# EAGLE schematic receiver_pcb (EAGLE 6.1)
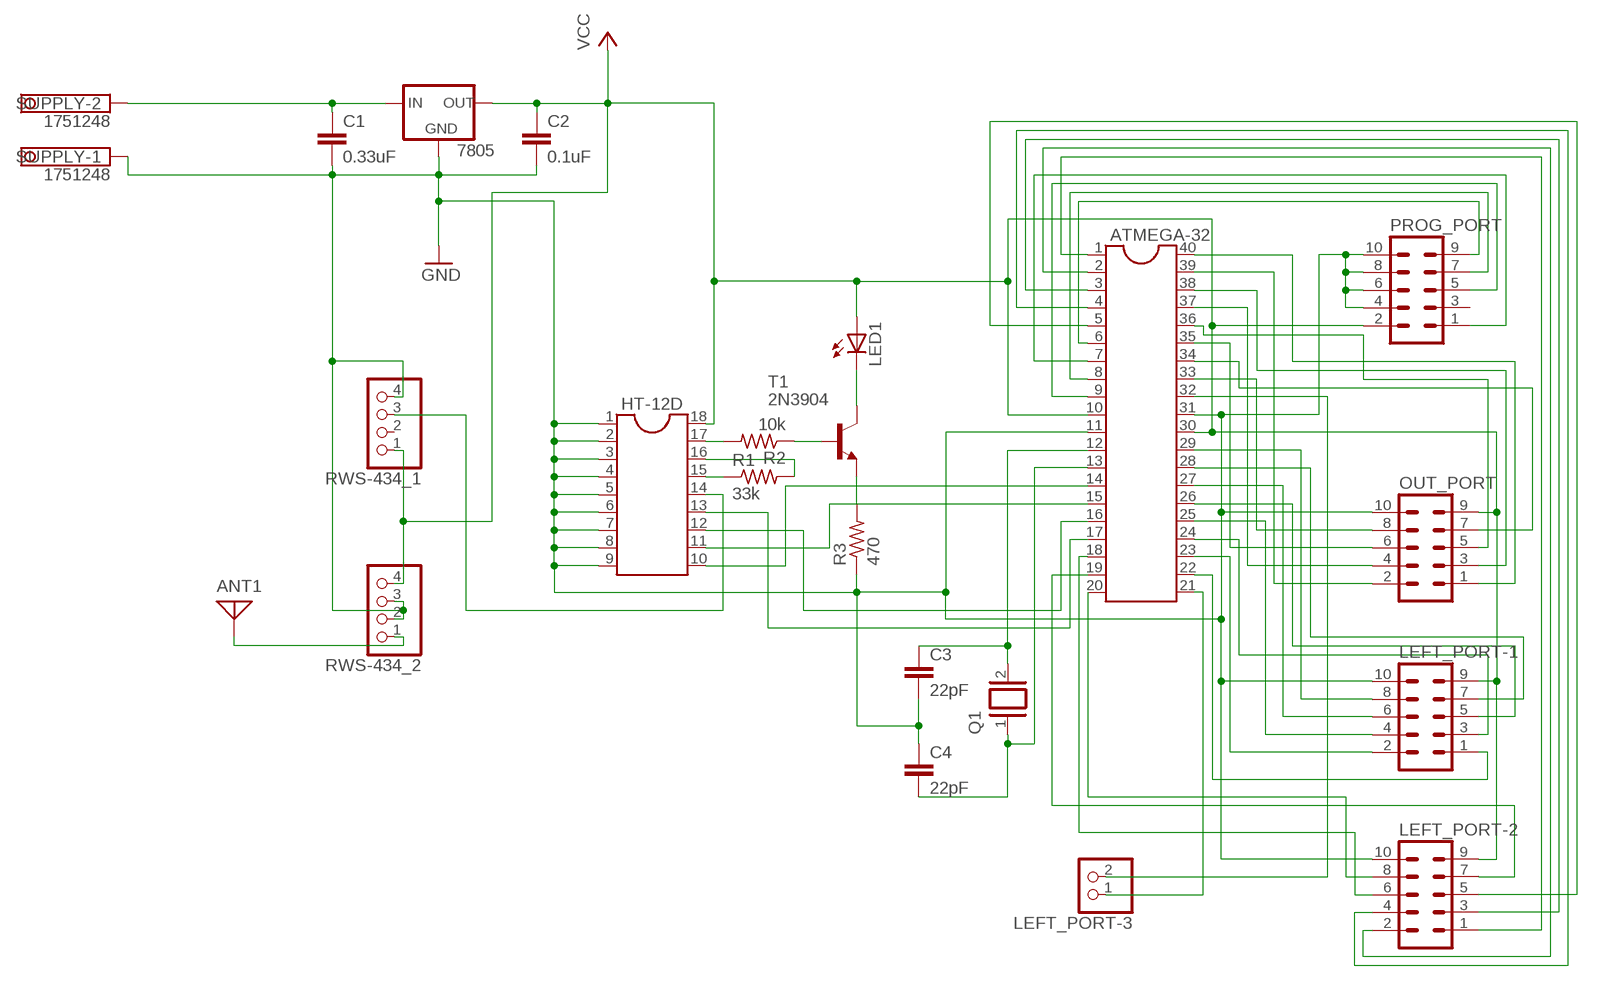
[diagram p0: schematic, sheet 1]

## Parts
7805  78XXS  [78XXS]
ANT1  ANTENNA  [PAD-01]
ATMEGA-32  DIL40  [DIL40]
C1  0.33uF  C2.5/2  [C2.5-2]
C2  0.1uF  C2.5/2  [C2.5-2]
C3  22pF  C2.5/2  [C2.5-2]
C4  22pF  C2.5/2  [C2.5-2]
HT-12D  DIL18  [DIL18]
LED1  LED5MM  [LED5MM]
LEFT_PORT-1  ML10  [ML10]
LEFT_PORT-2  ML10  [ML10]
LEFT_PORT-3  PINHD-1X2  [1X02]
OUT_PORT  ML10  [ML10]
PROG_PORT  ML10  [ML10]
Q1  XTAL/S  [QS]
R1  33k  R-US_0204/5  [0204/5]
R2  10k  R-US_0204/5  [0204/5]
R3  470  R-US_0204/5  [0204/5]
RWS-434_1  PINHD-1X4  [1X04]
RWS-434_2  PINHD-1X4  [1X04]
SUPPLY  1751248  [1751248]
T1  2N3904  [TO92]

## Nets
GND: 7805.GND ATMEGA-32.11 ATMEGA-32.31 C1.2 C2.2 C3.2 C4.1 HT-12D.1 HT-12D.2 HT-12D.3 HT-12D.4 HT-12D.5 HT-12D.6 HT-12D.7 HT-12D.8 HT-12D.9 LEFT_PORT-1.10 LEFT_PORT-2.10 OUT_PORT.10 PROG_PORT.4 PROG_PORT.6 PROG_PORT.8 PROG_PORT.10 R3.1 RWS-434_1.4 RWS-434_2.2 RWS-434_2.3 SUPPLY.1
N$1: HT-12D.17 R2.2
N$2: R2.1 T1.2(B)
N$3: 7805.IN C1.1 SUPPLY.2
N$4: R3.2 T1.3(E)
N$5: ANT1.1 RWS-434_2.1
N$6: LED1.K(C) T1.1(C)
N$7: HT-12D.14 RWS-434_1.3
N$8: HT-12D.15 R1.1
N$9: HT-12D.16 R1.2
N$10: ATMEGA-32.12 C3.1 Q1.2
N$11: ATMEGA-32.13 C4.2 Q1.1
N$12: ATMEGA-32.22 LEFT_PORT-1.1
N$13: ATMEGA-32.23 LEFT_PORT-1.2
N$14: ATMEGA-32.9 PROG_PORT.5
N$15: ATMEGA-32.24 LEFT_PORT-1.3
N$16: ATMEGA-32.6 PROG_PORT.9
N$17: ATMEGA-32.8 PROG_PORT.7
N$18: ATMEGA-32.7 PROG_PORT.1
N$19: ATMEGA-32.14 HT-12D.10
N$20: ATMEGA-32.15 HT-12D.11
N$21: ATMEGA-32.16 HT-12D.12
N$22: ATMEGA-32.17 HT-12D.13
N$23: ATMEGA-32.25 LEFT_PORT-1.4
N$24: ATMEGA-32.40 OUT_PORT.1
N$25: ATMEGA-32.39 OUT_PORT.2
N$26: ATMEGA-32.38 OUT_PORT.3
N$27: ATMEGA-32.37 OUT_PORT.4
N$28: ATMEGA-32.36 OUT_PORT.5
N$29: ATMEGA-32.35 OUT_PORT.6
N$30: ATMEGA-32.34 OUT_PORT.7
N$31: ATMEGA-32.33 OUT_PORT.8
N$32: ATMEGA-32.26 LEFT_PORT-1.5
N$33: ATMEGA-32.27 LEFT_PORT-1.6
N$34: ATMEGA-32.28 LEFT_PORT-1.7
N$35: ATMEGA-32.29 LEFT_PORT-1.8
N$36: ATMEGA-32.21 LEFT_PORT-3.1
N$37: ATMEGA-32.32 LEFT_PORT-3.2
N$38: ATMEGA-32.1 LEFT_PORT-2.1
N$39: ATMEGA-32.2 LEFT_PORT-2.2
N$40: ATMEGA-32.3 LEFT_PORT-2.3
N$41: ATMEGA-32.4 LEFT_PORT-2.4
N$42: ATMEGA-32.5 LEFT_PORT-2.5
N$43: ATMEGA-32.18 LEFT_PORT-2.6
N$44: ATMEGA-32.19 LEFT_PORT-2.7
N$45: ATMEGA-32.20 LEFT_PORT-2.8
VCC: 7805.OUT ATMEGA-32.10 ATMEGA-32.30 C2.1 HT-12D.18 LED1.A LEFT_PORT-1.9 LEFT_PORT-2.9 OUT_PORT.9 PROG_PORT.2 RWS-434_1.1 RWS-434_2.4
Unconnected: PROG_PORT.3 RWS-434_1.2

## Library data of the parts
7805 = v-reg:78XXS: VOLTAGE REGULATOR
ANT1 = discrete:ANTENNA: Antenna
ATMEGA-32 = ic-package:DIL40: Dual In Line
C1-C4 = capacitor-wima:C: CAPACITOR naming: grid - package width
HT-12D = ic-package:DIL18: Dual In Line / Socket
LED1 = led:LED: LED OSRAM: - CHIPLED LG R971, LG N971, LY N971, LG Q971, LY Q971, LO R971, LY R971 LH N974, LH R974 LS Q976, LO Q976, LY Q976 LO Q996 - Hyper CHIPLED LW Q18S LB Q993, LB Q99A, LB R99A - SideLED LS A670, LO A670, LY A670, LG A670, LP A670 LB A673, LV A673, LT A673, LW A673 LH A674 LY A675 LS A676, LA A676, LO A676, LY A676, LW A676 LS A679, LY A679, LG A679 - Hyper Micro SIDELED® LS Y876, LA Y876, LO Y876, LY Y876 LT Y87S - SmartLED LW L88C, LW L88S LB L89C, LB L89S, LG L890 LS L89K, LO L89K, LY L89K LS L896, LA L896, LO L896, LY L896 - TOPLED LS T670, LO T670, LY T670, LG T670, LP T670 LSG T670, LSP T670, LSY T670, LOP T670, LYG T670 LG T671, LOG T671, LSG T671 LB T673, LV T673, LT T673, LW T673 LH T674 LS T676, LA T676, LO T676, LY T676, LB T676, LH T676, LSB T676, LW T676 LB T67C, LV T67C, LT T67C, LS T67K, LO T67K, LY T67K, LW E67C LS E67B, LA E67B, LO E67B, LY E67B, LB E67C, LV E67C, LT E67C LW T67C LS T679, LY T679, LG T679 LS T770, LO T770, LY T770, LG T770, LP T770 LB T773, LV T773, LT T773, LW T773 LH T774 LS E675, LA E675, LY E675, LS T675 LS T776, LA T776, LO T776, LY T776, LB T776 LHGB T686 LT T68C, LB T68C - Hyper Mini TOPLED® LB M676 - Mini TOPLED Santana® LG M470 LS M47K, LO M47K, LY M47K Source: http://www.osram.convergy.de LUXEON: - LUMILED® LXK2-PW12-R00, LXK2-PW12-S00, LXK2-PW14-U00, LXK2-PW14-V00 LXK2-PM12-R00, LXK2-PM12-S00, LXK2-PM14-U00 LXK2-PE12-Q00, LXK2-PE12-R00, LXK2-PE12-S00, LXK2-PE14-T00, LXK2-PE14-U00 LXK2-PB12-K00, LXK2-PB12-L00, LXK2-PB12-M00, LXK2-PB14-N00, LXK2-PB14-P00, LXK2-PB14-Q00 LXK2-PR12-L00, LXK2-PR12-M00, LXK2-PR14-Q00, LXK2-PR14-R00 LXK2-PD12-Q00, LXK2-PD12-R00, LXK2-PD12-S00 LXK2-PH12-R00, LXK2-PH12-S00 LXK2-PL12-P00, LXK2-PL12-Q00, LXK2-PL12-R00 Source: www.luxeon.com KINGBRIGHT: KA-3528ASYC Source: www.kingbright.com
LEFT_PORT-1 LEFT_PORT-2 OUT_PORT PROG_PORT = con-harting-ml:ML10: HARTING; OC_FARNELL: unknown; OC_NEWARK: unknown
LEFT_PORT-3 = pinhead:PINHD-1X2: PIN HEADER
Q1 = special:XTAL/S: CRYSTAL
R1-R3 = resistor:R-US_: RESISTOR, American symbol
RWS-434_1 RWS-434_2 = pinhead:PINHD-1X4: PIN HEADER
SUPPLY = con-phoenix-350:1751248: MKDS 1/ 2-3,5 Printklemme Nennstrom: 10 A Bemessungsspannung: 160 V Raster: 3,5 mm Polzahl: 2 Montageart: Löten Anschlussart: Schraubanschluss Anschlussrichtung vom Leiter zur Platine: 0° Source: http://eshop.phoenixcontact.com .. 1751248.pdf; OC_FARNELL: unknown; OC_NEWARK: unknown
T1 = transistor:2N3904: NPN TRANSISTOR